# EAGLE schematic audiobus (EAGLE 5.11)
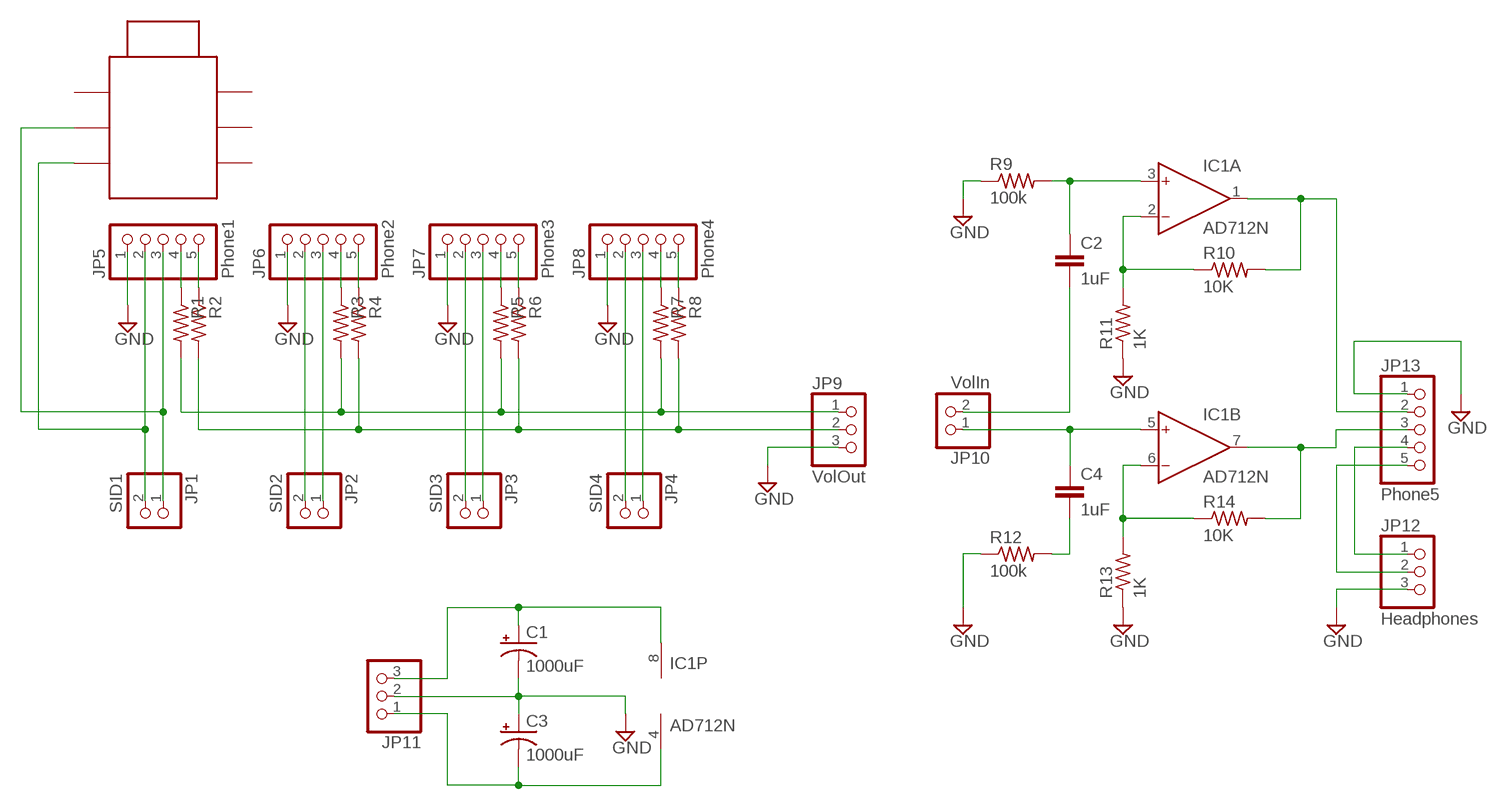
[diagram p0: schematic, sheet 1]

## Parts
C1  1000uF  CPOL-USE3.5-10  [E3,5-10]
C2  1uF  C5/7.2  [C5B7.2]
C3  1000uF  CPOL-USE3.5-10  [E3,5-10]
C4  1uF  C5/7.2  [C5B7.2]
IC1  AD712N  [DIL08]
JP1  SID1  PINHD-1X2  [1X02]
JP2  SID2  PINHD-1X2  [1X02]
JP3  SID3  PINHD-1X2  [1X02]
JP4  SID4  PINHD-1X2  [1X02]
JP5  Phone1  PINHD-1X5  [1X05]
JP6  Phone2  PINHD-1X5  [1X05]
JP7  Phone3  PINHD-1X5  [1X05]
JP8  Phone4  PINHD-1X5  [1X05]
JP9  VolOut  PINHD-1X3  [1X03]
JP10  VolIn  PINHD-1X2  [1X02]
JP11  PINHD-1X3  [1X03]
JP12  Headphones  PINHD-1X3  [1X03]
JP13  Phone5  PINHD-1X5  [1X05]
R1  R-US_0204/7  [0204/7]
R2  R-US_0204/7  [0204/7]
R3  R-US_0204/7  [0204/7]
R4  R-US_0204/7  [0204/7]
R5  R-US_0204/7  [0204/7]
R6  R-US_0204/7  [0204/7]
R7  R-US_0204/7  [0204/7]
R8  R-US_0204/7  [0204/7]
R9  100k  R-US_0204/7  [0204/7]
R10  10K  R-US_0204/7  [0204/7]
R11  1K  R-US_0204/7  [0204/7]
R12  100k  R-US_0204/7  [0204/7]
R13  1K  R-US_0204/7  [0204/7]
R14  10K  R-US_0204/7  [0204/7]
U$1  NMJ6HFD2  [NMJ6HFD2]

## Nets
GND: C1.- C3.+ JP5.1 JP6.1 JP7.1 JP8.1 JP9.3 JP11.2 JP13.1 R9.1 R11.1 R12.1 R13.1
N$1: JP1.1 JP5.3 U$1.RIGHT-IN
N$2: JP1.2 JP5.2 U$1.LEFT-IN
N$3: JP2.2 JP6.2
N$4: JP2.1 JP6.3
N$5: JP3.2 JP7.2
N$6: JP3.1 JP7.3
N$7: JP4.2 JP8.2
N$8: JP4.1 JP8.3
N$9: JP9.1 R1.2 R3.2 R5.2 R7.2
N$10: JP9.2 R2.2 R4.2 R6.2 R8.2
N$11: JP5.4 R1.1
N$12: JP5.5 R2.1
N$13: JP6.4 R3.1
N$14: JP6.5 R4.1
N$15: JP7.4 R5.1
N$16: JP7.5 R6.1
N$17: JP8.4 R7.1
N$18: JP8.5 R8.1
N$19: C2.2 JP10.2
N$20: C4.1 IC1.5(B:IN+) JP10.1
N$21: C2.1 IC1.3(A:IN+) R9.2
N$22: C1.+ IC1.8(P:V+) JP11.3
N$23: C3.- IC1.4(P:V-) JP11.1
N$25: IC1.2(A:IN-) R10.1 R11.2
N$26: IC1.1(A:OUT) JP13.2 R10.2
N$27: C4.2 R12.2
N$28: IC1.6(B:IN-) R13.2 R14.1
N$29: IC1.7(B:OUT) JP13.3 R14.2
N$30: JP12.1 JP13.4
N$31: JP12.2 JP13.5
N$32: JP12.3 ; supply symbol labelled GND
Unconnected: U$1.GND-IN U$1.GND-OUT U$1.LEFT-OUT U$1.RIGHT-OUT

## Library data of the parts
C1 C3 = rcl:CPOL-US: POLARIZED CAPACITOR, American symbol
C2 C4 = capacitor-wima:C: CAPACITOR naming: grid - package width
IC1 = analog-devices:AD712: Dual Precision, Low Cost, High Speed BiFET Op Amp Source: http://www.analog.com/static/imported-files/data_sheets/AD712.pdf; MF: ALTERA CORPORATION; MPN: AD712JNZ; OC_FARNELL: 9604898; OC_NEWARK: 59K4554
JP1-JP4 JP10 = pinhead:PINHD-1X2: PIN HEADER
JP5-JP8 JP13 = pinhead:PINHD-1X5: PIN HEADER
JP9 JP11 JP12 = pinhead:PINHD-1X3: PIN HEADER
R1-R8 = rcl:R-US_: RESISTOR, American symbol
R9-R14 = resistor:R-US_: RESISTOR, American symbol
U$1 = Neutrik:NMJ6HFD2